# Altium schematic sheet interface_com_usuario_motor_cartao.SchDoc
size A4; SheetNumber: 4; SheetTotal: 4
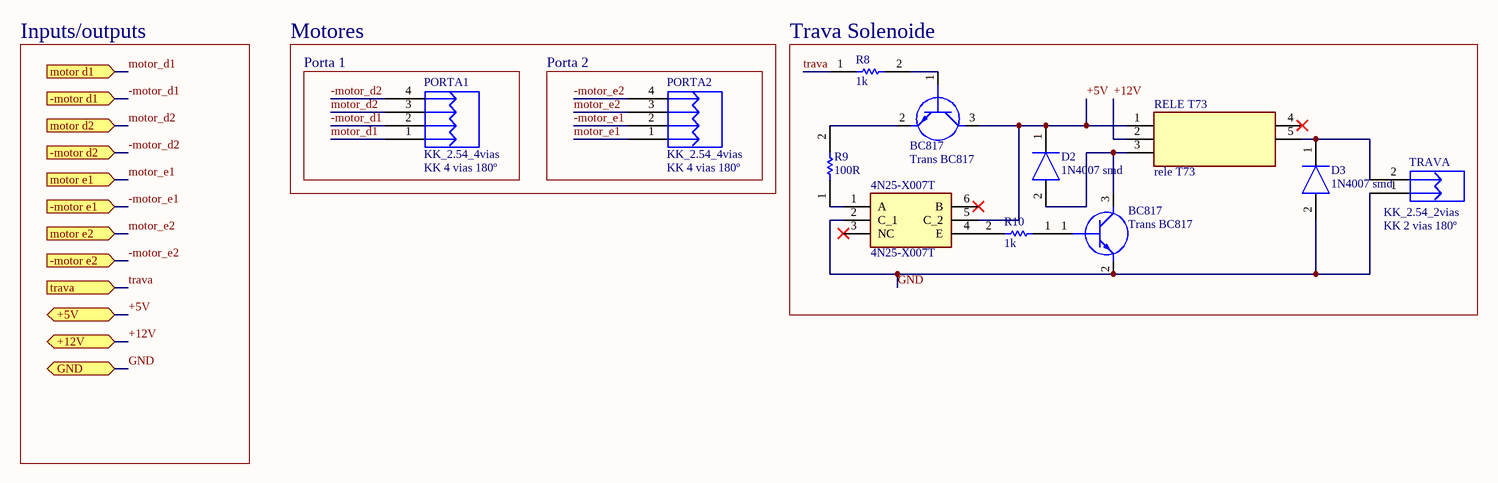
[diagram p0: interface_com_usuario_motor_cartao.SchDoc]

## Parts
(Parts that share a designator on the sheet are numbered #1, #2 ... from top to bottom, then left to right.)
4N25-X007T  4N25-X007T  [SOP254P1030X440-6N]
BC817#1  Trans BC817  [SOT96P240X110-3N]
BC817#2  Trans BC817  [SOT96P240X110-3N]
D2  1N4007 smd  [DIOM5327X242N]
D3  1N4007 smd  [DIOM5327X242N]
PORTA1  KK_2.54_4vias  Valor: KK 4 vias 180º  [KK_4vias_180°]
PORTA2  KK_2.54_4vias  Valor: KK 4 vias 180º  [KK_4vias_180°]
R8  1k  [RESC3216X60N]
R9  100R  [RESC3216X60N]
R10  1k  [RESC3216X60N]
RELE_T73  rele T73  [JQC3FT731Z12VDC]
TRAVA  KK_2.54_2vias  Valor: KK 2 vias 180º  [KK_2VIAS_180º]

## Blocks framed on the sheet
Trava Solenoide: 4N25-X007T BC817#1 BC817#2 D2 D3 R8-R10 RELE_T73 TRAVA
Porta 1: PORTA1
Porta 2: PORTA2

## Ports
+5V (bidir), +12V (bidir), -motor d1 (in), -motor d2 (in), -motor e1 (in), -motor e2 (in), GND (bidir), motor d1 (in), motor d2 (in), motor e1 (in), motor e2 (in), trava (in)

## Nets
+5V: 4N25-X007T.5(C_2) BC817#1.3(C) D2.1(K) RELE_T73.1(COIL_1) ; port +5V
+12V: RELE_T73.2(NC) ; port +12V
-motor_d1: PORTA1.2 ; port -motor d1
-motor_d2: PORTA1.4 ; port -motor d2
-motor_e1: PORTA2.2 ; port -motor e1
-motor_e2: PORTA2.4 ; port -motor e2
GND: 4N25-X007T.2(C_1) BC817#2.2(E) D3.2(A) TRAVA.1 ; port GND
motor_d1: PORTA1.1 ; port motor d1
motor_d2: PORTA1.3 ; port motor d2
motor_e1: PORTA2.1 ; port motor e1
motor_e2: PORTA2.3 ; port motor e2
trava: R8.1 ; port trava
Net4N25-X007T_1: 4N25-X007T.1(A) R9.1
Net4N25-X007T_4: 4N25-X007T.4(E) R10.2
NetBC817#1_1: BC817#1.1(B) R8.2
NetBC817#1_2: BC817#1.2(E) R9.2
NetBC817#2_1: BC817#2.1(B) R10.1
NetBC817#2_3: BC817#2.3(C) D2.2(A) RELE_T73.3(NO)
NetD3_1: D3.1(K) RELE_T73.5(COM) TRAVA.2

Not connected (* = marked no-connect by the designer): 4N25-X007T 3(NC)* 6(B)*; RELE_T73 4(COIL_2)*

## Notes on the sheet
- Inputs/outputs
- Motores

## Library data of the parts
4N25-X007T = 4N25-X007T: Phototransistor; Manufacturer_Name: Vishay; Datasheet Link: https://eu.mouser.com/datasheet/2/427/4n25x000-1767213.pdf; Height: 4.4mm; Manufacturer_Part_Number: 4N25-X007T; Mouser Part Number: 782-4N25-X007T; Mouser Price/Stock: https://www.mouser.com/Search/Refine.aspx?Keyword=782-4N25-X007T; Arrow Part Number: 4N25-X007T; Arrow Price/Stock: https://www.arrow.com/en/products/4n25-x007t/vishay
BC817#1 BC817#2 = Trans BC817: Transistor BJT NPN BC817-25-7-F; Manufacturer_Name: Diodes Inc.; Datasheet Link: https://www.diodes.com/assets/Datasheets/ds11107.pdf; Height: 1.1mm; Manufacturer_Part_Number: BC817-25-7-F; Mouser Part Number: 621-BC817-25-7-F; Mouser Price/Stock: https://www.mouser.co.uk/ProductDetail/Diodes-Incorporated/BC817-25-7-F?qs=rGAXPo9uwV0jK0EyLZnqOw%3D%3D; Arrow Part Number: BC817-25-7-F; Arrow Price/Stock: https://www.arrow.com/en/products/bc817-25-7-f/diodes-incorporated
D2 D3 = 1N4007 smd: Diode smd; Manufacturer_Name: Shikues; Datasheet Link: https://datasheet.lcsc.com/szlcsc/SK-1N4007_C126233.pdf; Height: 2.42mm; Manufacturer_Part_Number: 1N4007
PORTA1 PORTA2 = KK_2.54_4vias: Conector KK 2.54mm 4 vias; Descrição: Conector KK 3 vias com passo 2.54mm; Encapsulamento: PTH - 180º; Modelo: 3 vias - 180º; Marca: *; Observação: *
R8-R10 = RES 1206: RES 1206 5%; Manufacturer_Name: Vishay; Manufacturer_Part_Number: CRCW12064K70FKEA; Datasheet Link: http://docs-emea.rs-online.com/webdocs/13ec/0900766b813ecc08.pdf; Height: 0.6mm; Mouser Part Number: 71-CRCW1206-4.7K-E3; Mouser Price/Stock: https://www.mouser.co.uk/ProductDetail/Vishay-Dale/CRCW12064K70FKEA?qs=1vm4qhDHCvlKJmatsKzyFQ%3D%3D; Arrow Part Number: CRCW12064K70FKEA; Arrow Price/Stock: https://www.arrow.com/en/products/crcw12064k70fkea/vishay
RELE_T73 = rele T73: Relay or Contactor; Manufacturer_Name: QIANJI; Manufacturer_Part_Number: JQC-3F-(T73)-1Z-12VDC; Datasheet Link: https://img.ozdisan.com/ETicaret_Dosya/341245_8627675.pdf; Height: 15.5mm
TRAVA = KK_2.54_2vias: Conector KK 2.54mm 2 vias; Descrição: Conector KK 3 vias com passo 2.54mm; Encapsulamento: PTH - 180º; Modelo: 2 vias - 180º; Marca: *; Observação: *